# EAGLE schematic BSides 2015 RevA (EAGLE 7.2.0)
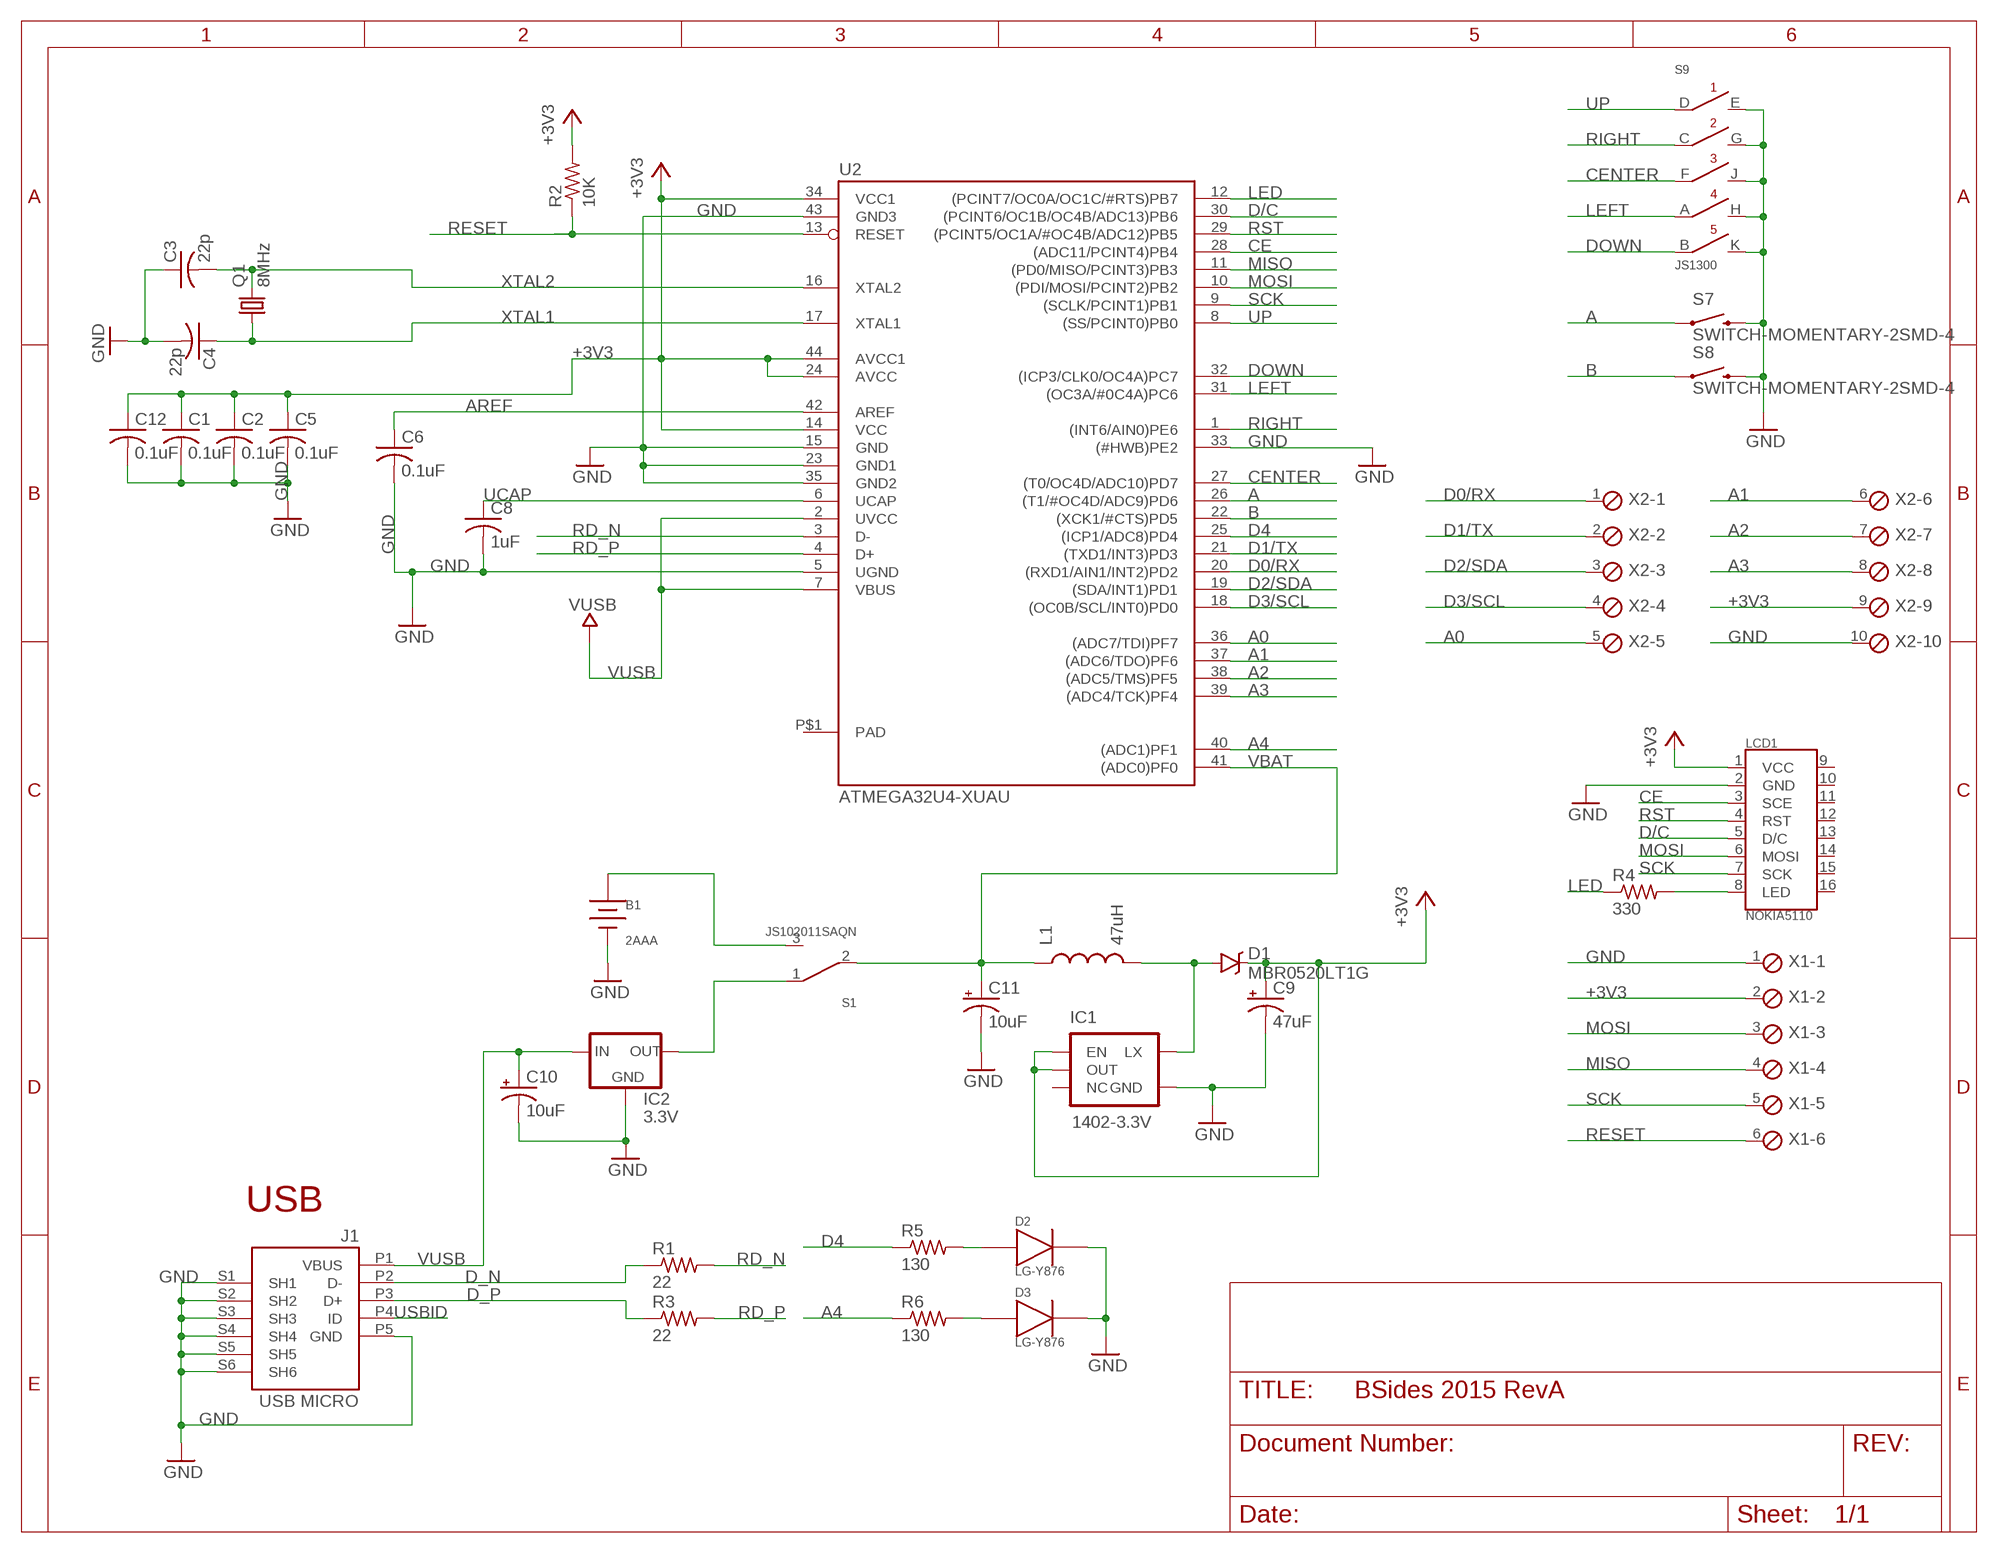
[diagram p0: schematic, sheet 1]

## Parts
B1  2AAA  [2AAA]
C1  0.1uF  C-USC0603K  [C0603K]
C2  0.1uF  C-USC0603K  [C0603K]
C3  22p  C-USC0603K  [C0603K]
C4  22p  C-USC0603K  [C0603K]
C5  0.1uF  C-USC0603K  [C0603K]
C6  0.1uF  C-USC0603K  [C0603K]
C8  1uF  C-USC0603K  [C0603K]
C9  47uF  CAP-TANT  [6032]
C10  10uF  10UF-16V-10%(TANT)  [EIA3216]
C11  10uF  10UF-16V-10%(TANT)  [EIA3216]
C12  0.1uF  C-USC0603K  [C0603K]
D1  MBR0520LT1G  [SOD-123]
D2  LG-Y876  [LG-Y876]
D3  LG-Y876  [LG-Y876]
IC1  1402-3.3V  V_REG_NCP1400SOT23-5  [SOT23-5]
IC2  3.3V  XC63FPM  [SOT23]
J1  USB MICRO  MYCON2_USB-MINI-B  [CON2_USB_MICRO_B_AT]
L1  47uH  NR6028  [NR6028]
LCD1  NOKIA5110  [5110]
Q1  8MHz  CRYSTALSM49  [SM49]
R1  22  R-US_R0603  [R0603]
R2  10K  R-US_R0603  [R0603]
R3  22  R-US_R0603  [R0603]
R4  330  R-US_R0603  [R0603]
R5  130  R-US_R0603  [R0603]
R6  130  R-US_R0603  [R0603]
S1  JS102011SAQN  [SAQN]
S7  SWITCH-MOMENTARY-2SMD-4  [TACTILE_SWITCH_TALL]
S8  SWITCH-MOMENTARY-2SMD-4  [TACTILE_SWITCH_TALL]
S9  JS1300  [JS1300]
U2  ATMEGA32U4-XUAU  [TQFP44-PAD]
X1  MPT6  [6POL254]
X2  MPT10  [10POL254]

## Nets
+3V3 [usbvcc]: C1.1 C2.1 C5.1 C9.P$2(+) C12.1 D1.P$1(C) IC1.1(EN) IC1.2(OUT) LCD1.1(VCC) R2.2 U2.14(VCC) U2.24(AVCC) U2.34(VCC1) U2.44(AVCC1) X1.2 X2.9
A: S7.A2 U2.26((T1/#OC4D/ADC9)PD6)
A0: U2.36((ADC7/TDI)PF7) X2.5
A1: U2.37((ADC6/TDO)PF6) X2.6
A2: U2.38((ADC5/TMS)PF5) X2.7
A3: U2.39((ADC4/TCK)PF4) X2.8
A4: R6.1 U2.40((ADC1)PF1)
AREF [aref]: C6.1 U2.42(AREF)
B: S8.A2 U2.22((XCK1/#CTS)PD5)
CE: LCD1.3(SCE) U2.28((ADC11/PCINT4)PB4)
CENTER: S9.F U2.27((T0/OC4D/ADC10)PD7)
D0/RX: U2.20((RXD1/AIN1/INT2)PD2) X2.1
D1/TX: U2.21((TXD1/INT3)PD3) X2.2
D2/SDA: U2.19((SDA/INT1)PD1) X2.3
D3/SCL: U2.18((OC0B/SCL/INT0)PD0) X2.4
D4: R5.1 U2.25((ICP1/ADC8)PD4)
D/C: LCD1.5(D/C) U2.30((PCINT6/OC1B/OC4B/ADC13)PB6)
D_N: J1.P2(D-) R1.1
D_P: J1.P3(D+) R3.1
DOWN: S9.B U2.32((ICP3/CLK0/OC4A)PC7)
GND [gnd]: B1.- C1.2 C2.2 C3.1 C4.2 C5.2 C6.2 C8.2 C9.P$1(-) C10.C(-) C11.C(-) C12.2 D2.C D3.C IC1.4(GND) IC2.1(GND) J1.P5(GND) J1.S1(SH1) J1.S2(SH2) J1.S3(SH3) J1.S4(SH4) J1.S5(SH5) J1.S6(SH6) LCD1.2(GND) S7.B2 S8.B2 S9.E S9.G S9.H S9.J S9.K U2.5(UGND) U2.15(GND) U2.23(GND1) U2.33((#HWB)PE2) U2.35(GND2) U2.43(GND3) X1.1 X2.10
LED: R4.1 U2.12((PCINT7/OC0A/OC1C/#RTS)PB7)
LEFT: S9.A U2.31((OC3A/#0C4A)PC6)
MISO: U2.11((PD0/MISO/PCINT3)PB3) X1.4
MOSI: LCD1.6(MOSI) U2.10((PDI/MOSI/PCINT2)PB2) X1.3
N$1: D1.P$2(A) IC1.5(LX) L1.P$2
N$2: IC2.2(OUT) S1.1
N$3: B1.+ S1.3
N$22: LCD1.8(LED) R4.2
N$234: D2.A R5.2
N$235: D3.A R6.2
RD_N: R1.2 U2.3(D-)
RD_P: R3.2 U2.4(D+)
RESET: R2.1 U2.13(RESET) X1.6
RIGHT: S9.C U2.1((INT6/AIN0)PE6)
RST: LCD1.4(RST) U2.29((PCINT5/OC1A/#OC4B/ADC12)PB5)
SCK: LCD1.7(SCK) U2.9((SCLK/PCINT1)PB1) X1.5
UCAP: C8.1 U2.6(UCAP)
UP: S9.D U2.8((SS/PCINT0)PB0)
USBID: J1.P4(ID)
VBAT: C11.A(+) L1.P$1 S1.2 U2.41((ADC0)PF0)
VUSB: C10.A(+) IC2.3(IN) J1.P1(VBUS) U2.2(UVCC) U2.7(VBUS)
XTAL1: C4.1 Q1.1 U2.17(XTAL1)
XTAL2: C3.2 Q1.2 U2.16(XTAL2)
Unconnected: IC1.3(NC) LCD1.9 LCD1.10 LCD1.11 LCD1.12 LCD1.13 LCD1.14 LCD1.15 LCD1.16

## Notes on the sheet
- USB

## Power pins joined to a net without a drawn wire
PAD: U2.P$1(PAD)

## Library data of the parts
B1 = BatteryHolders:2AAA
C1-C6 C8 C12 = resistor:C-US: CAPACITOR, American symbol
C9 = cap-tant-6032:CAP-TANT
C10 C11 = SparkFun-Capacitors:10UF-16V-10%(TANT): CAP-00811 1206/EIA-3216 Tantalum capacitor; PROD_ID: CAP-00811
D1 = mbr0520lt1g:MBR0520LT1G
D2 D3 = LG-Y876:LG-Y876
IC1 = SparkFun-PowerIC:V_REG_NCP1400: Switching step-up voltage regulator NCP1400 switiching regulator takes single cell AA and outputs 100mA at 3.3V or 5V with minimal number of external components.
IC2 = v-reg:XC63FP: Positiv Voltage Regulators www.torex.co.jp/english/product/pro02/pdf/0201_xc62fp.pdf
J1 = SmartPrj:MYCON2_USB-MINI-B
L1 = NR6028:NR6028
LCD1 = Nokia5110LCD:NOKIA5110
Q1 = crystal:CRYSTAL: CRYSTAL; OC_FARNELL: unknown; OC_NEWARK: unknown
R1-R6 = resistor:R-US_: RESISTOR, American symbol
S1 = ck-comp-js-switches:JS102011SAQN: CK-Components JS Series Sub-Miniature Slide Switches SPDT SMD Right Angle
S7 S8 = SparkFun-Electromechanical:SWITCH-MOMENTARY-2: Various NO switches- pushbuttons, reed, etc; PROD_ID: SWCH-11966
S9 = Eswitch-JS1300:JS1300
U2 = SmartPrj:ATMEGA32U4-XU
X1 = con-phoenix-254:MPT6: PHOENIX CONNECTOR; OC_FARNELL: unknown; OC_NEWARK: unknown
X2 = con-phoenix-254:MPT10: PHOENIX CONNECTOR; OC_FARNELL: unknown; OC_NEWARK: unknown

## Net classes
0 default: width 0.254 mm, drill 0.61 mm, clearance 0.254 mm
1 power: width 0.254 mm, drill 0.61 mm, clearance 0.254 mm
2 gnd: width 0.254 mm, drill 0.61 mm, clearance 0.254 mm
3 usbvcc: width 0.254 mm, drill 0.61 mm, clearance 0.254 mm
4 aref: width 0.254 mm, drill 0.61 mm, clearance 0.254 mm